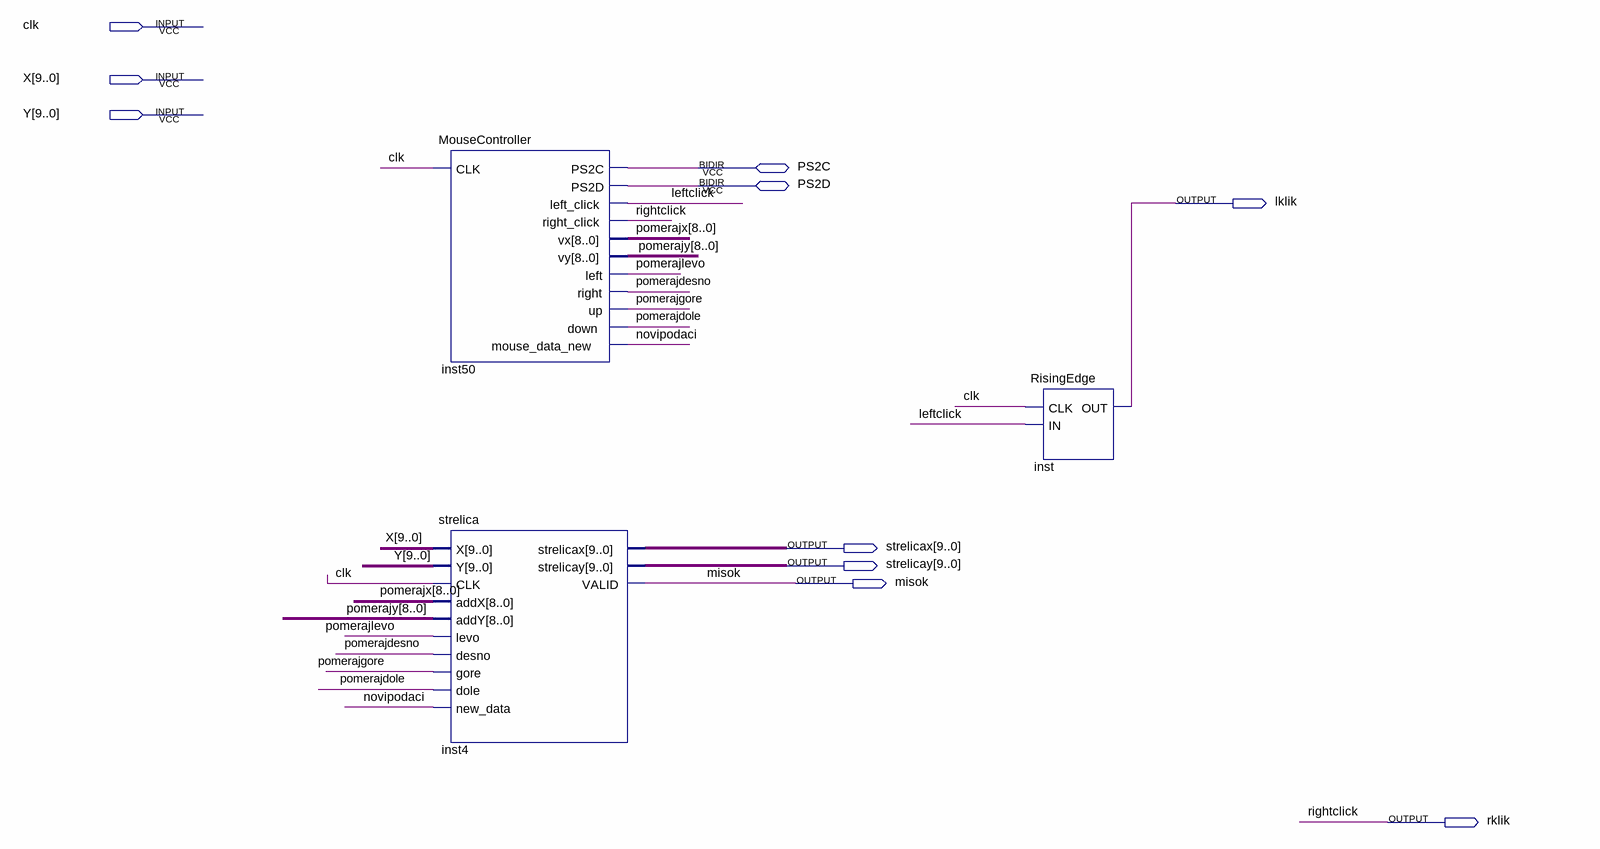
[diagram p0: schematic sheet]
// Quartus schematic pomeranje_strelice.bdf as structural Verilog: 3 symbols, 10 pins
module pomeranje_strelice (
  input  clk,
  input  [9:0] X,
  input  [9:0] Y,
  inout  PS2C,
  inout  PS2D,
  output lklik,
  output [9:0] strelicax,
  output [9:0] strelicay,
  output misok,
  output rklik
);

  wire leftclick, novipodaci, pomerajdesno, pomerajdole, pomerajgore, pomerajlevo;
  wire [8:0] pomerajx, pomerajy;

  MouseController inst50 (
    .CLK(clk), .left_click(leftclick), .right_click(rklik), .vx(pomerajx), .vy(pomerajy), .left(pomerajlevo),
    .right(pomerajdesno), .up(pomerajgore), .down(pomerajdole), .mouse_data_new(novipodaci), .PS2C(PS2C),
    .PS2D(PS2D));
  strelica inst4 (
    .X(X), .Y(Y), .CLK(clk), .addX(pomerajx), .addY(pomerajy), .levo(pomerajlevo), .desno(pomerajdesno),
    .gore(pomerajgore), .dole(pomerajdole), .new_data(novipodaci), .strelicax(strelicax),
    .strelicay(strelicay), .VALID(misok));
  RisingEdge inst (.CLK(clk), .IN(leftclick), .OUT(lklik));

  // Other names for the same wires on the sheet: rightclick = rklik
endmodule
